# EAGLE board axiom_beta_power_board_v0.10_test (EAGLE 7.0.0), part 1 of 3
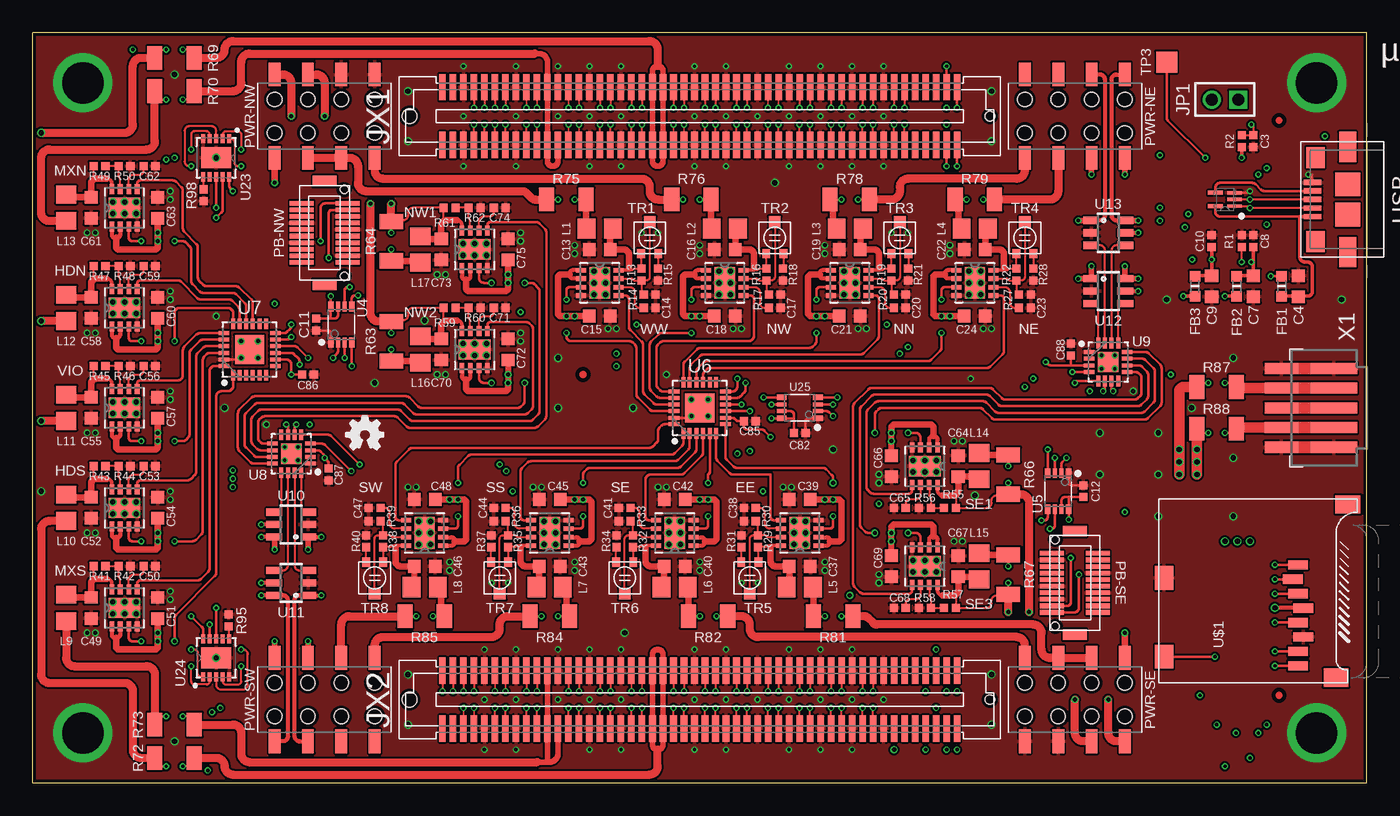
[diagram p10: board, top side]
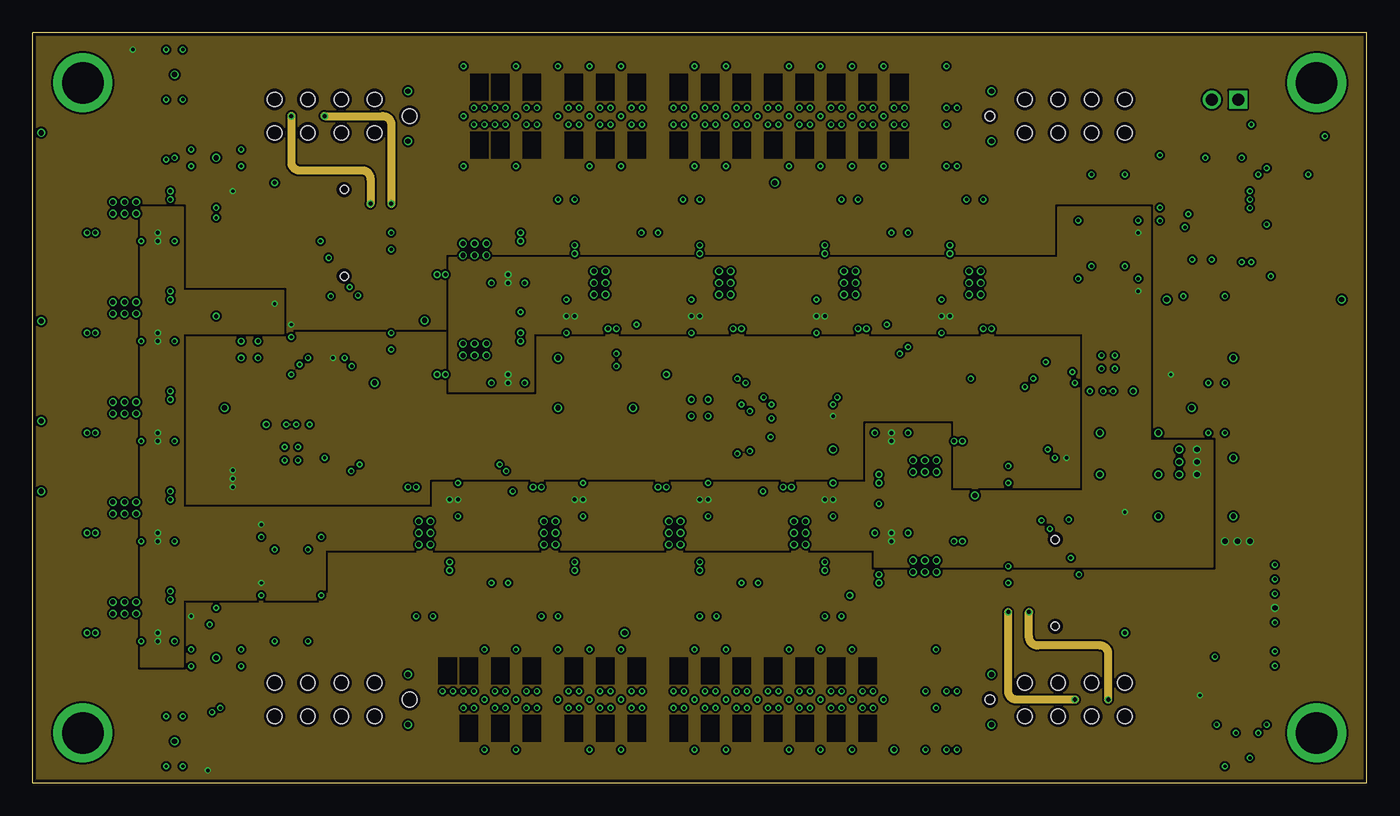
[diagram p11: board, inner layer Route2]
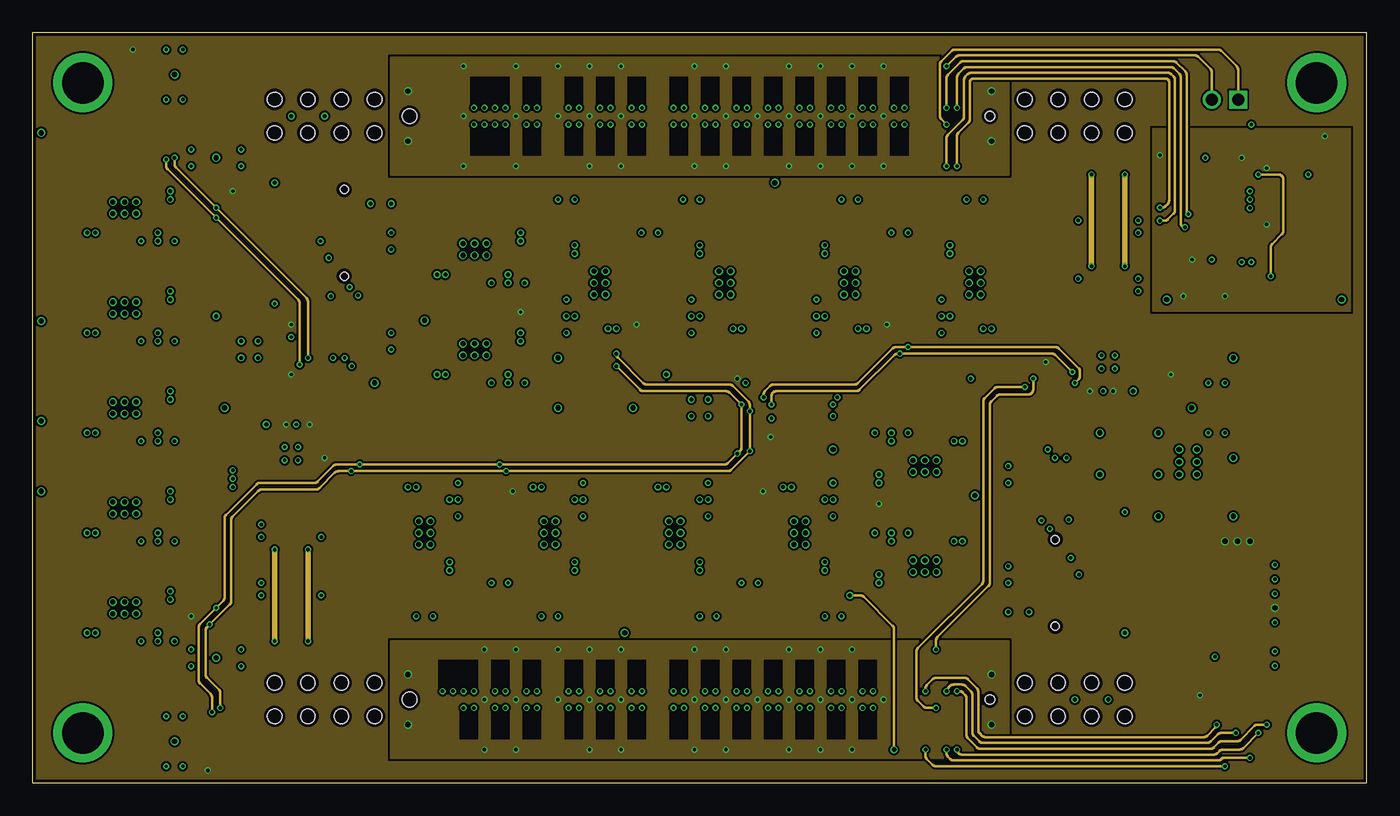
[diagram p12: board, inner layer Route15]
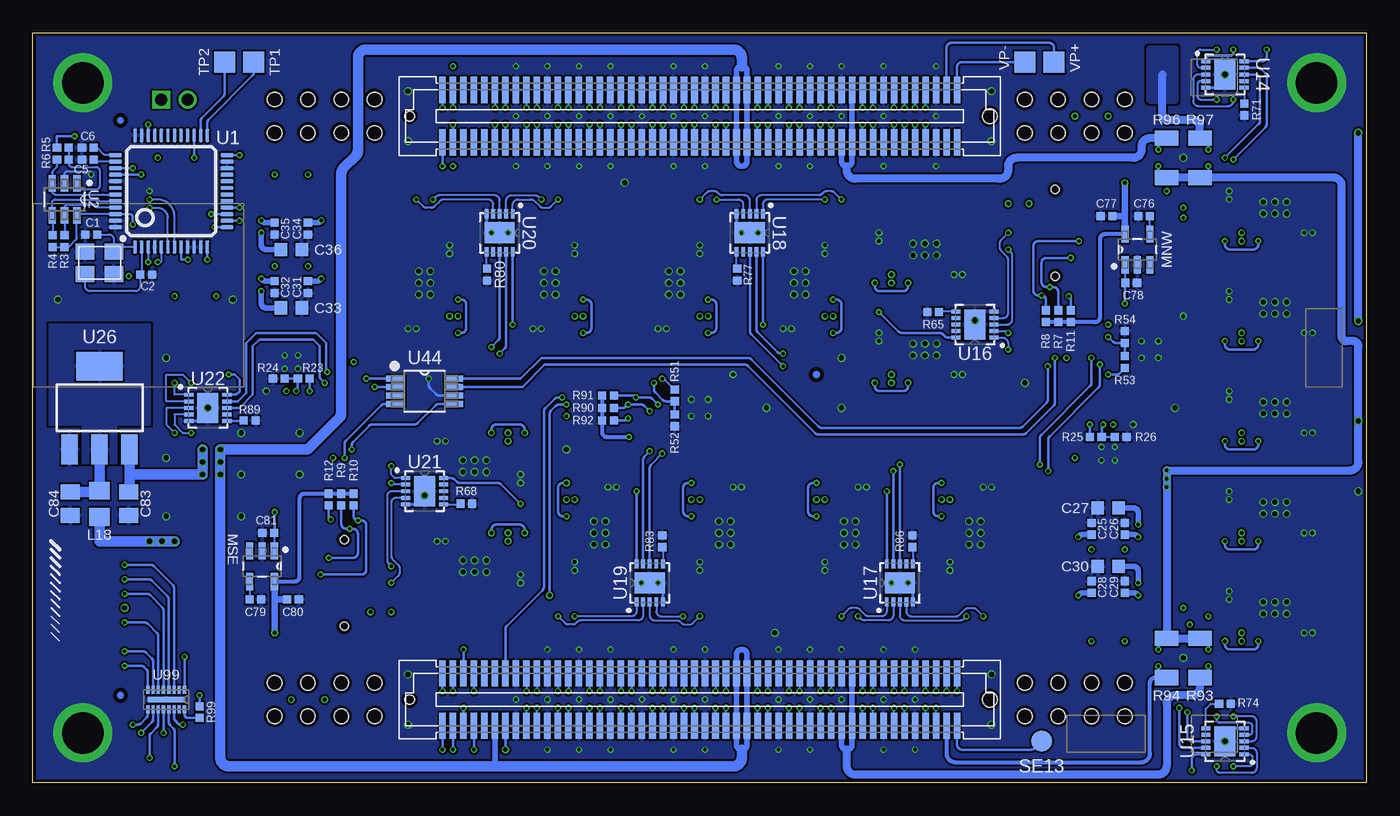
[diagram p13: board, bottom side, seen from below]

Size 101.6 x 57.15 mm. Coordinates in mm from the lower left corner, seen from the top.
Outline: 101.6,57.15 0,57.15 0,0 101.6,0 101.6,57.15
Copper layers (1*2*15*16): Top 0.035559375mm / dielectric 0.17018125mm / Route2 0.01778125mm / dielectric 47mil / Route15 0.01778125mm / dielectric 0.17018125mm / Bottom 0.035559375mm
Design rules "OSHPark-4layer-tuned *": minimum track width 5mil, minimum drill 10mil, track to track 6mil, track to pad 5mil, pad to pad 5mil, via to via 5mil, smd to smd 0mil, copper to edge 10mil, drill to drill 6mil, minimum pad ring 4mil, minimum via ring 4mil, stop-mask expansion 2mil, vias tented up to drill 16mil, thermal gap 6mil
Net classes: 1 LVDS: width 0.152 mm, drill 0.254 mm, clearance 0.152 mm
tKeepout: area 95.3,50.8 to 100.3,55.8; area 95.3,1.3 to 100.3,6.3; area 1.3,1.3 to 6.3,6.3; area 1.3,50.8 to 6.3,55.8
bKeepout: area 95.3,50.8 to 100.3,55.8; area 95.3,1.3 to 100.3,6.3; area 1.3,1.3 to 6.3,6.3; area 1.3,50.8 to 6.3,55.8
tRestrict: area 94.4,49.9 to 95.5,51; area 94.4,6.1 to 95.5,7.2; area 41.4,30.6 to 42.5,31.7
bRestrict: area 94.4,49.9 to 95.5,51; area 94.4,6.1 to 95.5,7.2; area 41.4,30.6 to 42.5,31.7

## Footprints (pad centres in the part's own frame; a part is rotated, then mirrored left to right if it is on the bottom)
µZ-SOCKET-NOHOLES = smd 0.5 x 2: 1 -19.6,-24.425; 2 -19.6,-20.027; 3 -18.8,-24.425; 4 -18.8,-20.027; 5 -18,-24.425; 6 -18,-20.027; 7 -17.2,-24.425; 8 -17.2,-20.027; 9 -16.4,-24.425; 10 -16.4,-20.027; 11 -15.6,-24.425; 12 -15.6,-20.027; 13 -14.8,-24.425; 14 -14.8,-20.027; 15 -14,-24.425; 16 -14,-20.027; 17 -13.2,-24.425; 18 -13.2,-20.027; 19 -12.4,-24.425; 20 -12.4,-20.027; 21 -11.6,-24.425; 22 -11.6,-20.027; 23 -10.8,-24.425; 24 -10.8,-20.027; 25 -10,-24.425; 26 -10,-20.027; 27 -9.2,-24.425; 28 -9.2,-20.027; 29 -8.4,-24.425; 30 -8.4,-20.027; 31 -7.6,-24.425; 32 -7.6,-20.027; 33 -6.8,-24.425; 34 -6.8,-20.027; 35 -6,-24.425; 36 -6,-20.027; 37 -5.2,-24.425; 38 -5.2,-20.027; 39 -4.4,-24.425; 40 -4.4,-20.027; 41 -3.6,-24.425; 42 -3.6,-20.027; 43 -2.8,-24.425; 44 -2.8,-20.027; 45 -2,-24.425; 46 -2,-20.027; 47 -1.2,-24.425; 48 -1.2,-20.027; 49 -0.4,-24.425; 50 -0.4,-20.027; 51 0.4,-24.425; 52 0.4,-20.027; 53 1.2,-24.425; 54 1.2,-20.027; 55 2,-24.425; 56 2,-20.027; 57 2.8,-24.425; 58 2.8,-20.027; 59 3.6,-24.425; 60 3.6,-20.027; 61 4.4,-24.425; 62 4.4,-20.027; 63 5.2,-24.425; 64 5.2,-20.027; 65 6,-24.425; 66 6,-20.027; 67 6.8,-24.425; 68 6.8,-20.027; 69 7.6,-24.425; 70 7.6,-20.027; 71 8.4,-24.425; 72 8.4,-20.027; 73 9.2,-24.425; 74 9.2,-20.027; 75 10,-24.425; 76 10,-20.027; 77 10.8,-24.425; 78 10.8,-20.027; 79 11.6,-24.425; 80 11.6,-20.027; 81 12.4,-24.425; 82 12.4,-20.027; 83 13.2,-24.425; 84 13.2,-20.027; 85 14,-24.425; 86 14,-20.027; 87 14.8,-24.425; 88 14.8,-20.027; 89 15.6,-24.425; 90 15.6,-20.027; 91 16.4,-24.425; 92 16.4,-20.027; 93 17.2,-24.425; 94 17.2,-20.027; 95 18,-24.425; 96 18,-20.027; 97 18.8,-24.425; 98 18.8,-20.027; 99 19.6,-24.425; 100 19.6,-20.027; 101 -19.6,20.025; 102 -19.6,24.425; 103 -18.8,20.027; 104 -18.8,24.425; 105 -18,20.027; 106 -18,24.425; 107 -17.2,20.027; 108 -17.2,24.425; 109 -16.4,20.027; 110 -16.4,24.425; 111 -15.6,20.027; 112 -15.6,24.425; 113 -14.8,20.027; 114 -14.8,24.425; 115 -14,20.027; 116 -14,24.425; 117 -13.2,20.027; 118 -13.2,24.425; 119 -12.4,20.027; 120 -12.4,24.425; 121 -11.6,20.027; 122 -11.6,24.425; 123 -10.8,20.027; 124 -10.8,24.425; 125 -10,20.027; 126 -10,24.425; 127 -9.2,20.027; 128 -9.2,24.425; 129 -8.4,20.027; 130 -8.4,24.425; 131 -7.6,20.027; 132 -7.6,24.425; 133 -6.8,20.027; 134 -6.8,24.425; 135 -6,20.027; 136 -6,24.425; 137 -5.2,20.027; 138 -5.2,24.425; 139 -4.4,20.027; 140 -4.4,24.425; 141 -3.6,20.027; 142 -3.6,24.425; 143 -2.8,20.027; 144 -2.8,24.425; 145 -2,20.027; 146 -2,24.425; 147 -1.2,20.027; 148 -1.2,24.425; 149 -0.4,20.027; 150 -0.4,24.425; 151 0.4,20.027; 152 0.4,24.425; 153 1.2,20.027; 154 1.2,24.425; 155 2,20.027; 156 2,24.425; 157 2.8,20.027; 158 2.8,24.425; 159 3.6,20.027; 160 3.6,24.425; 161 4.4,20.027; 162 4.4,24.425; 163 5.2,20.027; 164 5.2,24.425; 165 6,20.027; 166 6,24.425; 167 6.8,20.027; 168 6.8,24.425; 169 7.6,20.027; 170 7.6,24.425; 171 8.4,20.027; 172 8.4,24.425; 173 9.2,20.027; 174 9.2,24.425; 175 10,20.027; 176 10,24.425; 177 10.8,20.027; 178 10.8,24.425; 179 11.6,20.027; 180 11.6,24.425; 181 12.4,20.027; 182 12.4,24.425; 183 13.2,20.027; 184 13.2,24.425; 185 14,20.027; 186 14,24.425; 187 14.8,20.027; 188 14.8,24.425; 189 15.6,20.027; 190 15.6,24.425; 191 16.4,20.027; 192 16.4,24.425; 193 17.2,20.027; 194 17.2,24.425; 195 18,20.027; 196 18,24.425; 197 18.8,20.027; 198 18.8,24.425; 199 19.6,20.027; 200 19.6,24.425 | hole 0.725: -22.1,-22.225; -22.1,22.225 | hole 1.125: 22.1,-22.225; 22.1,22.225
0402-B = smd 0.62 x 0.62: 1 -0.45,0; 2 0.45,0
0603-B = smd 0.95 x 1: 1 -0.8,0; 2 0.8,0
0805-B = smd 1.15 x 1.45: 1 -0.9,0; 2 0.9,0
DFN65P300X300X100-9N = smd 0.762 x 0.356: 1 -1.422,0.965; 2 -1.422,0.33; 3 -1.422,-0.33; 4 -1.422,-0.965; 5 1.422,-0.965; 6 1.422,-0.33; 7 1.422,0.33; 8 1.422,0.965 | smd 1.549 x 2.413: 9 0,0
_0603MP = smd 0.8 x 0.8: 1 -0.762,0; 2 0.762,0
1X02M = drill 0.914 square: 1 -1,0 | drill 0.914: 2 1,0
0805-A = smd 1.35 x 1.55: 1 -1,0; 2 1,0
SOT95P280X145-5N = smd 1.321 x 0.559: 1 -1.168,0.94; 2 -1.168,0; 3 -1.168,-0.94; 4 1.168,-0.94; 5 1.168,0.94
DF12(XX)-20DP-0.5V = smd 1.8 x 0.35: 1 -1.75,2.25; 2 1.75,2.25; 3 -1.75,1.75; 4 1.75,1.75; 5 -1.75,1.25; 6 1.75,1.25; 7 -1.75,0.75; 8 1.75,0.75; 9 -1.75,0.25; 10 1.75,0.25; 11 -1.75,-0.25; 12 1.75,-0.25; 13 -1.75,-0.75; 14 1.75,-0.75; 15 -1.75,-1.25; 16 1.75,-1.25; 17 -1.75,-1.75; 18 1.75,-1.75; 19 -1.75,-2.25; 20 1.75,-2.25 | smd 1.8 x 0.8: M1 0,3.95; M2 0,-3.95 | hole 0.625: 1.5,-3.3; 1.5,3.3
R2X04 = smd 0.9 x 1.8: 1 -3.81,3.175; 2 -3.81,-3.175; 3 -1.27,3.175; 4 -1.27,-3.175; 5 1.27,3.175; 6 1.27,-3.175; 7 3.81,3.175; 8 3.81,-3.175 | hole 1.1: -3.81,1.27; -1.27,1.27; -1.27,-1.27; -3.81,-1.27; 1.27,1.27; 1.27,-1.27; 3.81,1.27; 3.81,-1.27
ABM8G = smd 1.4 x 1.2: 1 -1.1,-0.85; 2 1.1,-0.85; 3 1.1,0.85; 4 -1.1,0.85
1206-B = smd 1.15 x 1.8: 1 -1.5,0; 2 1.5,0
TP16R = smd 1.6 x 1.6: TP 0,0
TP16SQ = smd 1.6 x 1.6: TP 0,0
TRIM-PVZ2A = smd 0.6 x 0.7: 1 -0.65,-1.2; 3 0.65,-1.2 | smd 0.9 x 0.9: 2 0,1.2
LQFP48 = smd 0.3 x 1: 1 -2.75,-4.25; 2 -2.25,-4.25; 3 -1.75,-4.25; 4 -1.25,-4.25; 5 -0.75,-4.25; 6 -0.25,-4.25; 7 0.25,-4.25; 8 0.75,-4.25; 9 1.25,-4.25; 10 1.75,-4.25; 11 2.25,-4.25; 12 2.75,-4.25; 25 2.75,4.25; 26 2.25,4.25; 27 1.75,4.25; 28 1.25,4.25; 29 0.75,4.25; 30 0.25,4.25; 31 -0.25,4.25; 32 -0.75,4.25; 33 -1.25,4.25; 34 -1.75,4.25; 35 -2.25,4.25; 36 -2.75,4.25 | smd 1 x 0.3: 13 4.25,-2.75; 14 4.25,-2.25; 15 4.25,-1.75; 16 4.25,-1.25; 17 4.25,-0.75; 18 4.25,-0.25; 19 4.25,0.25; 20 4.25,0.75; 21 4.25,1.25; 22 4.25,1.75; 23 4.25,2.25; 24 4.25,2.75; 37 -4.25,2.75; 38 -4.25,2.25; 39 -4.25,1.75; 40 -4.25,1.25; 41 -4.25,0.75; 42 -4.25,0.25; 43 -4.25,-0.25; 44 -4.25,-0.75; 45 -4.25,-1.25; 46 -4.25,-1.75; 47 -4.25,-2.25; 48 -4.25,-2.75
SOT95P280X145-6N = smd 1.27 x 0.559: 1 -1.219,0.94; 2 -1.219,0; 3 -1.219,-0.94; 4 1.219,-0.94; 5 1.219,0; 6 1.219,0.94
SOT50P160X60-5N = smd 1.118 x 0.254: 1 -0.737,0.508; 2 -0.737,0; 3 -0.737,-0.508 | smd 1.118 x 0.305: 4 0.737,-0.508; 5 0.737,0.508
VSSOP-8 = smd 0.75 x 0.4: 1 -1.375,0.8; 4 -1.375,-0.8; 5 1.375,-0.8; 8 1.375,0.8 | smd 0.75 x 0.3: 2 -1.375,0.25; 3 -1.375,-0.25; 6 1.375,-0.25; 7 1.375,0.25
QFN50P400X400X80-25N = smd 0.813 x 0.305: 1 -1.956,1.245; 2 -1.956,0.762; 3 -1.956,0.254; 4 -1.956,-0.254; 5 -1.956,-0.762; 6 -1.956,-1.245; 13 1.956,-1.245; 14 1.956,-0.762; 15 1.956,-0.254; 16 1.956,0.254; 17 1.956,0.762; 18 1.956,1.245 | smd 0.305 x 0.813: 7 -1.245,-1.956; 8 -0.762,-1.956; 9 -0.254,-1.956; 10 0.254,-1.956; 11 0.762,-1.956; 12 1.245,-1.956; 19 1.245,1.956; 20 0.762,1.956; 21 0.254,1.956; 22 -0.254,1.956; 23 -0.762,1.956; 24 -1.245,1.956 | smd 2.21 x 2.21: 25 0,0
QFN50P300X300X80-17N = smd 0.813 x 0.305: 1 -1.448,0.762; 2 -1.448,0.254; 3 -1.448,-0.254; 4 -1.448,-0.762; 9 1.448,-0.762; 10 1.448,-0.254; 11 1.448,0.254; 12 1.448,0.762 | smd 0.305 x 0.813: 5 -0.762,-1.448; 6 -0.254,-1.448; 7 0.254,-1.448; 8 0.762,-1.448; 13 0.762,1.448; 14 0.254,1.448; 15 -0.254,1.448; 16 -0.762,1.448 | smd 1.549 x 1.549: EP 0,0
SOT23-6 = smd 0.55 x 1.2: 1 -0.95,-1.3; 2 0,-1.3; 3 0.95,-1.3; 4 0.95,1.3; 5 0,1.3; 6 -0.95,1.3
DFN3X3_10LEAD = smd 0.7 x 0.3: 1 -1.45,1; 2 -1.45,0.5; 3 -1.45,0; 4 -1.45,-0.5; 5 -1.45,-1; 6 1.45,-1; 7 1.45,-0.5; 8 1.45,0; 9 1.45,0.5; 10 1.45,1 | smd 1.6 x 2.3: EPAD 0,0
SOT-223 = smd 1.27 x 2.286: 1 -2.286,-3.175; 2 0,-3.175; 3 2.286,-3.175 | smd 3.556 x 2.159: TER 0,3.175
SOP65P490X110-8N = smd 1.422 x 0.457: 1 -2.21,0.965; 2 -2.21,0.33; 3 -2.21,-0.33; 4 -2.21,-0.965; 5 2.21,-0.965; 6 2.21,-0.33; 7 2.21,0.33; 8 2.21,0.965
SON40P135X330X55-17N = smd 0.61 x 0.254: 1 -0.737,1.397; 2 -0.737,0.991; 3 -0.737,0.61; 4 -0.737,0.203; 5 -0.737,-0.203; 6 -0.737,-0.61; 7 -0.737,-0.991; 8 -0.737,-1.397; 9 0.737,-1.397; 10 0.737,-0.991; 11 0.737,-0.61; 12 0.737,-0.203; 13 0.737,0.203; 14 0.737,0.61; 15 0.737,0.991; 16 0.737,1.397 | smd 0.406 x 2.794: 17 0,0
TF-MICRO-SD_PP2 = smd 0.7 x 1.5: 1 9,-10.64; 2 7.9,-10.24; 3 6.8,-10.64; 4 5.7,-11.04; 5 4.6,-10.64; 6 3.5,-11.04; 7 2.4,-10.64; 8 1.3,-10.64 | smd 1.8 x 1.4: CD1 2,-0.44; CD2 8,-0.44 | smd 1.4 x 1.9: MT1 0.4,-13.54; MT2 13.6,-14.44
MICRO-AB-H-SMT = smd 0.4 x 1.35: 1 -1.3,4.125; 2 -0.65,4.125; 3 0,4.125; 4 0.65,4.125; 5 1.3,4.125 | smd 2.3 x 1.3: Z1 -4,1.45; Z4 4,1.45 | smd 1.8 x 1.9: Z2 -1.15,1.45; Z3 1.15,1.45 | smd 1.6 x 1.4: Z5 -3.2,3.9; Z6 3.2,3.9
PICO-SPOX-5 = smd 0.85 x 2.55: 1 -3,-6.5; 2 -1.5,-6.5; 3 0,-6.5; 4 1.5,-6.5; 5 3,-6.5 | smd 0.85 x 3.55: 1A -3,-2.5; 2A -1.5,-2.5; 3A 0,-2.5; 4A 1.5,-2.5; 5A 3,-2.5
µZ-CONONLY = smd 0.5 x 2: 1 19.6,-24.226; 2 19.6,-20.226; 3 18.8,-24.226; 4 18.8,-20.226; 5 18,-24.226; 6 18,-20.226; 7 17.2,-24.226; 8 17.2,-20.226; 9 16.4,-24.226; 10 16.4,-20.226; 11 15.6,-24.226; 12 15.6,-20.226; 13 14.8,-24.226; 14 14.8,-20.226; 15 14,-24.226; 16 14,-20.226; 17 13.2,-24.226; 18 13.2,-20.226; 19 12.4,-24.226; 20 12.4,-20.226; 21 11.6,-24.226; 22 11.6,-20.226; 23 10.8,-24.226; 24 10.8,-20.226; 25 10,-24.226; 26 10,-20.226; 27 9.2,-24.226; 28 9.2,-20.226; 29 8.4,-24.226; 30 8.4,-20.226; 31 7.6,-24.226; 32 7.6,-20.226; 33 6.8,-24.226; 34 6.8,-20.226; 35 6,-24.226; 36 6,-20.226; 37 5.2,-24.226; 38 5.2,-20.226; 39 4.4,-24.226; 40 4.4,-20.226; 41 3.6,-24.226; 42 3.6,-20.226; 43 2.8,-24.226; 44 2.8,-20.226; 45 2,-24.226; 46 2,-20.226; 47 1.2,-24.226; 48 1.2,-20.226; 49 0.4,-24.226; 50 0.4,-20.226; 51 -0.4,-24.226; 52 -0.4,-20.226; 53 -1.2,-24.226; 54 -1.2,-20.226; 55 -2,-24.226; 56 -2,-20.226; 57 -2.8,-24.226; 58 -2.8,-20.226; 59 -3.6,-24.226; 60 -3.6,-20.226; 61 -4.4,-24.226; 62 -4.4,-20.226; 63 -5.2,-24.226; 64 -5.2,-20.226; 65 -6,-24.226; 66 -6,-20.226; 67 -6.8,-24.226; 68 -6.8,-20.226; 69 -7.6,-24.226; 70 -7.6,-20.226; 71 -8.4,-24.226; 72 -8.4,-20.226; 73 -9.2,-24.226; 74 -9.2,-20.226; 75 -10,-24.226; 76 -10,-20.226; 77 -10.8,-24.226; 78 -10.8,-20.226; 79 -11.6,-24.226; 80 -11.6,-20.226; 81 -12.4,-24.226; 82 -12.4,-20.226; 83 -13.2,-24.226; 84 -13.2,-20.226; 85 -14,-24.226; 86 -14,-20.226; 87 -14.8,-24.226; 88 -14.8,-20.226; 89 -15.6,-24.226; 90 -15.6,-20.226; 91 -16.4,-24.226; 92 -16.4,-20.226; 93 -17.2,-24.226; 94 -17.2,-20.226; 95 -18,-24.226; 96 -18,-20.226; 97 -18.8,-24.226; 98 -18.8,-20.226; 99 -19.6,-24.226; 100 -19.6,-20.226; 101 19.6,20.226; 102 19.6,24.226; 103 18.8,20.226; 104 18.8,24.226; 105 18,20.226; 106 18,24.226; 107 17.2,20.226; 108 17.2,24.226; 109 16.4,20.226; 110 16.4,24.226; 111 15.6,20.226; 112 15.6,24.226; 113 14.8,20.226; 114 14.8,24.226; 115 14,20.226; 116 14,24.226; 117 13.2,20.226; 118 13.2,24.226; 119 12.4,20.226; 120 12.4,24.226; 121 11.6,20.226; 122 11.6,24.226; 123 10.8,20.226; 124 10.8,24.226; 125 10,20.226; 126 10,24.226; 127 9.2,20.226; 128 9.2,24.226; 129 8.4,20.226; 130 8.4,24.226; 131 7.6,20.226; 132 7.6,24.226; 133 6.8,20.226; 134 6.8,24.226; 135 6,20.226; 136 6,24.226; 137 5.2,20.226; 138 5.2,24.226; 139 4.4,20.226; 140 4.4,24.226; 141 3.6,20.226; 142 3.6,24.226; 143 2.8,20.226; 144 2.8,24.226; 145 2,20.226; 146 2,24.226; 147 1.2,20.226; 148 1.2,24.226; 149 0.4,20.226; 150 0.4,24.226; 151 -0.4,20.226; 152 -0.4,24.226; 153 -1.2,20.226; 154 -1.2,24.226; 155 -2,20.226; 156 -2,24.226; 157 -2.8,20.226; 158 -2.8,24.226; 159 -3.6,20.226; 160 -3.6,24.226; 161 -4.4,20.226; 162 -4.4,24.226; 163 -5.2,20.226; 164 -5.2,24.226; 165 -6,20.226; 166 -6,24.226; 167 -6.8,20.226; 168 -6.8,24.226; 169 -7.6,20.226; 170 -7.6,24.226; 171 -8.4,20.226; 172 -8.4,24.226; 173 -9.2,20.226; 174 -9.2,24.226; 175 -10,20.226; 176 -10,24.226; 177 -10.8,20.226; 178 -10.8,24.226; 179 -11.6,20.226; 180 -11.6,24.226; 181 -12.4,20.226; 182 -12.4,24.226; 183 -13.2,20.226; 184 -13.2,24.226; 185 -14,20.226; 186 -14,24.226; 187 -14.8,20.226; 188 -14.8,24.226; 189 -15.6,20.226; 190 -15.6,24.226; 191 -16.4,20.226; 192 -16.4,24.226; 193 -17.2,20.226; 194 -17.2,24.226; 195 -18,20.226; 196 -18,24.226; 197 -18.8,20.226; 198 -18.8,24.226; 199 -19.6,20.226; 200 -19.6,24.226 | hole 1.125: -22.1,-22.225; -22.1,22.225 | hole 0.725: 22.1,-22.225; 22.1,22.225

## Placement (x,y rotation side)
BETA  µZ-FCI-SOCKET-NOHOLES  [µZ-SOCKET-NOHOLES]  50.8,28.57 180 top
C1  [0402-B]  97.16,41.78 180 bottom
C2  [0402-B]  92.96,38.73 0 bottom
C3  10n  [0402-B]  92.96,48.89 270 top
C4  100n  [0603-B]  96.39,37.85 90 top
C5  100n  [0402-B]  97.41,47.5 180 bottom
C6  100n  [0402-B]  97.41,48.39 180 bottom
C7  4µ7  [0603-B]  92.96,37.85 270 top
C8  100n  [0402-B]  92.96,41.27 90 top
C9  4µ7  [0603-B]  89.79,37.85 270 top
C10  100n  [0402-B]  89.79,41.27 90 top
C11  [0402-B]  21.59,34.92 270 top
C12  [0402-B]  80.01,22.23 90 top
C13  [0603-B]  43.18,40.64 180 top
C14  [0402-B]  46.99,36.2 0 top
C15  [0603-B]  43.18,35.56 0 top
C16  [0603-B]  52.7,40.64 180 top
C17  [0402-B]  56.52,36.2 0 top
C18  [0603-B]  52.7,35.56 0 top
C19  [0603-B]  62.23,40.64 180 top
C20  [0402-B]  66.04,36.2 0 top
C21  [0603-B]  62.23,35.56 0 top
C22  [0603-B]  71.75,40.64 180 top
C23  [0402-B]  75.56,36.2 0 top
C24  [0603-B]  71.75,35.56 0 top
C25  1µ  [0402-B]  20.95,19.37 90 bottom
C26  1µ  [0402-B]  18.41,19.37 90 bottom
C27  1µ  [0603-B]  19.68,20.95 180 bottom
C28  1µ  [0402-B]  20.95,14.92 90 bottom
C29  1µ  [0402-B]  18.41,14.92 90 bottom
C30  1µ  [0603-B]  19.68,16.51 180 bottom
C31  1µ  [0402-B]  80.64,37.78 270 bottom
C32  1µ  [0402-B]  83.19,37.78 270 bottom
C33  1µ  [0603-B]  81.91,36.2 0 bottom
C34  1µ  [0402-B]  80.64,42.23 270 bottom
C35  1µ  [0402-B]  83.19,42.23 270 bottom
C36  1µ  [0603-B]  81.91,40.64 0 bottom
C37  [0603-B]  58.42,16.51 0 top
C38  [0402-B]  54.61,20.95 180 top
C39  [0603-B]  58.42,21.59 180 top
C40  [0603-B]  48.89,16.51 0 top
C41  [0402-B]  45.08,20.95 180 top
C42  [0603-B]  48.89,21.59 180 top
C43  [0603-B]  39.37,16.51 0 top
C44  [0402-B]  35.56,20.95 180 top
C45  [0603-B]  39.37,21.59 180 top
C46  [0603-B]  29.84,16.51 0 top
C47  [0402-B]  26.03,20.95 180 top
C48  [0603-B]  29.84,21.59 180 top
C49  [0603-B]  4.45,13.33 270 top
C50  [0402-B]  8.89,16.51 0 top
C51  [0603-B]  9.52,13.33 90 top
C52  [0603-B]  4.45,20.95 270 top
C53  [0402-B]  8.89,24.13 0 top
C54  [0603-B]  9.52,20.95 90 top
C55  [0603-B]  4.45,28.57 270 top
C56  [0402-B]  8.89,31.75 0 top
C57  [0603-B]  9.52,28.57 90 top
C58  [0603-B]  4.45,36.2 270 top
C59  [0402-B]  8.89,39.37 0 top
C60  [0603-B]  9.52,36.2 90 top
C61  [0603-B]  4.45,43.81 270 top
C62  [0402-B]  8.89,46.99 0 top
C63  [0603-B]  9.52,43.81 90 top
C64  [0603-B]  70.48,24.13 90 top
C65  [0402-B]  66.04,20.95 180 top
C66  [0603-B]  65.41,24.13 270 top
C67  [0603-B]  70.48,16.51 90 top
C68  [0402-B]  66.04,13.33 180 top
C69  [0603-B]  65.41,16.51 270 top
C70  [0603-B]  31.11,33.02 270 top
C71  [0402-B]  35.56,36.2 0 top
C72  [0603-B]  36.19,33.02 90 top
C73  [0603-B]  31.11,40.64 270 top
C74  [0402-B]  35.56,43.81 0 top
C75  [0603-B]  36.19,40.64 90 top
C76  [0402-B]  16.95,43.18 180 bottom
C77  [0402-B]  19.81,43.18 180 bottom
C78  [0402-B]  17.93,38.1 0 bottom
C79  [0402-B]  84.65,13.97 0 bottom
C80  [0402-B]  81.79,13.97 0 bottom
C81  [0402-B]  83.67,19.05 180 bottom
C82  [0402-B]  58.42,26.67 0 top
C83  [0805-B]  94.3,21.27 270 bottom
C84  [0805-B]  98.74,21.27 270 bottom
C85  [0402-B]  54.61,27.56 0 top
C86  [0402-B]  20.95,31.11 0 top
C87  [0402-B]  22.54,23.49 270 top
C88  [0402-B]  79.06,33.02 90 top
EE  MCP1727-ADJE/MF  [DFN65P300X300X100-9N]  58.42,19.05 180 top
FB1  600R  [_0603MP]  95.12,37.85 90 top
FB2  600R  [_0603MP]  91.69,37.85 90 top
FB3  600R  [_0603MP]  88.52,37.85 90 top
HDN  MCP1727-ADJE/MF  [DFN65P300X300X100-9N]  6.98,36.2 90 top
HDS  MCP1727-ADJE/MF  [DFN65P300X300X100-9N]  6.98,20.95 90 top
JP1  [1X02M]  90.81,52.07 180 top
L1  [0805-A]  43.18,42.23 180 top
L2  [0805-A]  52.7,42.23 180 top
L3  [0805-A]  62.23,42.23 180 top
L4  [0805-A]  71.75,42.23 180 top
L5  [0805-A]  58.42,14.92 0 top
L6  [0805-A]  48.89,14.92 0 top
L7  [0805-A]  39.37,14.92 0 top
L8  [0805-A]  29.84,14.92 0 top
L9  [0805-A]  2.54,13.33 270 top
L10  [0805-A]  2.54,20.95 270 top
L11  [0805-A]  2.54,28.57 270 top
L12  [0805-A]  2.54,36.2 270 top
L13  [0805-A]  2.54,43.81 270 top
L14  [0805-A]  72.07,24.13 90 top
L15  [0805-A]  72.07,16.51 90 top
L16  [0805-A]  29.53,33.02 270 top
L17  [0805-A]  29.53,40.64 270 top
L18  [0805-A]  96.52,21.27 270 bottom
LOGO1  OSHW_LOGO_FILLX0100-NT  [OSHW_FILLX100_NOTEXT]  23.88,25.4 0 top
MNW  SPX3819M5-L  [SOT95P280X145-5N]  17.46,40.64 90 bottom
MSE  SPX3819M5-L  [SOT95P280X145-5N]  84.14,16.51 270 bottom
MXN  MCP1727-ADJE/MF  [DFN65P300X300X100-9N]  6.98,43.81 90 top
MXS  MCP1727-ADJE/MF  [DFN65P300X300X100-9N]  6.98,13.33 90 top
NE  MCP1727-ADJE/MF  [DFN65P300X300X100-9N]  71.75,38.1 0 top
NN  MCP1727-ADJE/MF  [DFN65P300X300X100-9N]  62.23,38.1 0 top
NW  MCP1727-ADJE/MF  [DFN65P300X300X100-9N]  52.7,38.1 0 top
NW1  MCP1727-ADJE/MF  [DFN65P300X300X100-9N]  33.66,40.64 90 top
NW2  MCP1727-ADJE/MF  [DFN65P300X300X100-9N]  33.66,33.02 90 top
PB-NW  DF12(XX)-20DP-0.5V  [DF12(XX)-20DP-0.5V]  22.22,41.91 0 top
PB-SE  DF12(XX)-20DP-0.5V  [DF12(XX)-20DP-0.5V]  79.38,15.24 180 top
PWR-NE  PINRC-2X04  [R2X04]  79.38,50.8 180 top
PWR-NW  PINRC-2X04  [R2X04]  22.22,50.8 0 top
PWR-SE  PINRC-2X04  [R2X04]  79.38,6.35 180 top
PWR-SW  PINRC-2X04  [R2X04]  22.22,6.35 0 top
Q1  SMD-4P-2G-3.2X2.5  [ABM8G]  96.52,39.62 180 bottom
R1  12k  [0402-B]  92.07,41.27 270 top
R2  10k  [0402-B]  92.07,48.89 270 top
R3  10k  [0402-B]  99.19,41.27 270 bottom
R4  10k  [0402-B]  100.08,41.27 270 bottom
R5  10k  [0402-B]  99.31,48.39 180 bottom
R6  2k  [0402-B]  99.31,47.5 180 bottom
R7  [0402-B]  23.49,35.56 90 bottom
R8  [0402-B]  24.45,35.56 90 bottom
R9  [0402-B]  78.1,21.59 270 bottom
R10  [0402-B]  77.15,21.59 270 bottom
R11  [0402-B]  22.54,35.56 90 bottom
R12  [0402-B]  79.06,21.59 270 bottom
R13  [0402-B]  46.35,38.73 270 top
R14  [0402-B]  46.99,37.21 0 top
R15  [0402-B]  47.62,38.73 270 top
R16  [0402-B]  55.88,38.73 270 top
R17  [0402-B]  56.52,37.21 0 top
R18  [0402-B]  57.15,38.73 270 top
R19  [0402-B]  65.41,38.73 270 top
R20  [0402-B]  66.04,37.21 0 top
R21  [0402-B]  66.67,38.73 270 top
R22  [0402-B]  74.93,38.73 270 top
R23  [0402-B]  80.96,30.8 180 bottom
R24  [0402-B]  82.87,30.8 180 bottom
R25  [0402-B]  20.64,26.35 0 bottom
R26  [0402-B]  18.73,26.35 0 bottom
R27  [0402-B]  75.56,37.21 0 top
R28  [0402-B]  76.2,38.73 270 top
R29  [0402-B]  55.24,18.41 90 top
R30  [0402-B]  54.61,19.94 180 top
R31  [0402-B]  53.97,18.41 90 top
R32  [0402-B]  45.72,18.41 90 top
R33  [0402-B]  45.08,19.94 180 top
R34  [0402-B]  44.45,18.41 90 top
R35  [0402-B]  36.19,18.41 90 top
R36  [0402-B]  35.56,19.94 180 top
R37  [0402-B]  34.92,18.41 90 top
R38  [0402-B]  26.67,18.41 90 top
R39  [0402-B]  26.03,19.94 180 top
R40  [0402-B]  25.4,18.41 90 top
R41  [0402-B]  5.08,16.51 0 top
R42  [0402-B]  6.98,16.51 0 top
R43  [0402-B]  5.08,24.13 0 top
R44  [0402-B]  6.98,24.13 0 top
R45  [0402-B]  5.08,31.75 0 top
R46  [0402-B]  6.98,31.75 0 top
R47  [0402-B]  5.08,39.37 0 top
R48  [0402-B]  6.98,39.37 0 top
R49  [0402-B]  5.08,46.99 0 top
R50  [0402-B]  6.98,46.99 0 top
R51  [0402-B]  52.7,29.53 270 bottom
R52  [0402-B]  52.7,27.62 270 bottom
R53  [0402-B]  18.41,32.07 90 bottom
R54  [0402-B]  18.41,33.97 90 bottom
R55  [0402-B]  69.85,20.95 180 top
R56  [0402-B]  67.94,20.95 180 top
R57  [0402-B]  69.85,13.33 180 top
R58  [0402-B]  67.94,13.33 180 top
R59  [0402-B]  31.75,36.2 0 top
R60  [0402-B]  33.66,36.2 0 top
R61  [0402-B]  31.75,43.81 0 top
R62  [0402-B]  33.66,43.81 0 top
R63  [1206-B]  27.3,33.66 90 top
R64  [1206-B]  27.3,41.27 90 top
R65  [0402-B]  33.02,35.88 180 bottom
R66  [1206-B]  74.3,23.49 270 top
R67  [1206-B]  74.3,15.88 270 top
R68  [0402-B]  68.58,21.27 0 bottom
R69  [1206-B]  10.79,55.25 0 top
R70  [1206-B]  10.79,52.7 0 top
R71  [0402-B]  9.33,51.31 270 bottom
R72  [1206-B]  10.79,1.9 0 top
R73  [1206-B]  10.79,4.45 0 top
R74  [0402-B]  10.79,6.03 0 bottom
R75  [1206-B]  40.64,44.45 180 top
R76  [1206-B]  50.16,44.45 180 top
R77  [0402-B]  47.94,38.73 270 bottom
R78  [1206-B]  62.23,44.45 0 top
R79  [1206-B]  71.75,44.45 0 top
R80  [0402-B]  66.99,38.73 270 bottom
R81  [1206-B]  60.96,12.7 0 top
R82  [1206-B]  51.43,12.7 0 top
R83  [0402-B]  53.66,18.41 90 bottom
R84  [1206-B]  39.37,12.7 180 top
R85  [1206-B]  29.84,12.7 180 top
R86  [0402-B]  34.61,18.41 90 bottom
R87  [1206-B]  90.17,30.16 180 top
R88  [1206-B]  90.17,26.99 180 top
R89  [0402-B]  85.09,27.62 0 bottom
R90  [0402-B]  57.78,28.57 0 bottom
R91  [0402-B]  57.78,29.53 0 bottom
R92  [0402-B]  57.78,27.62 0 bottom
R93  [1206-B]  12.7,9.52 270 bottom
R94  [1206-B]  15.24,9.52 270 bottom
R95  [0402-B]  14.92,12.38 90 top
R96  [1206-B]  15.24,47.62 90 bottom
R97  [1206-B]  12.7,47.62 90 bottom
R98  [0402-B]  13.02,44.77 270 top
R99  [0402-B]  88.9,5.4 270 bottom
SE  MCP1727-ADJE/MF  [DFN65P300X300X100-9N]  48.89,19.05 180 top
SE1  MCP1727-ADJE/MF  [DFN65P300X300X100-9N]  67.94,24.13 270 top
SE3  MCP1727-ADJE/MF  [DFN65P300X300X100-9N]  67.94,16.51 270 top
SE13  TPTP16R  [TP16R]  24.76,3.18 90 bottom
SS  MCP1727-ADJE/MF  [DFN65P300X300X100-9N]  39.37,19.05 180 top
SW  MCP1727-ADJE/MF  [DFN65P300X300X100-9N]  29.84,19.05 180 top
TP1  TPTP16SQ  [TP16SQ]  84.77,54.93 270 bottom
TP2  TPTP16SQ  [TP16SQ]  87,54.93 270 bottom
TP3  TPTP16SQ  [TP16SQ]  86.36,54.93 0 top
TR1  PVZ2A  [TRIM-PVZ2A]  46.99,41.53 0 top
TR2  PVZ2A  [TRIM-PVZ2A]  56.52,41.53 0 top
TR3  PVZ2A  [TRIM-PVZ2A]  66.04,41.53 0 top
TR4  PVZ2A  [TRIM-PVZ2A]  75.56,41.53 0 top
TR5  PVZ2A  [TRIM-PVZ2A]  54.61,15.62 180 top
TR6  PVZ2A  [TRIM-PVZ2A]  45.08,15.62 180 top
TR7  PVZ2A  [TRIM-PVZ2A]  35.56,15.62 180 top
TR8  PVZ2A  [TRIM-PVZ2A]  26.03,15.62 180 top
U1  FT232H  [LQFP48]  91.06,45.09 0 bottom
U2  93LC46BT-I/OT  [SOT95P280X145-6N]  99.19,44.45 270 bottom
U3  TPD3E001DRLR  [SOT50P160X60-5N]  90.81,44.45 180 top
U4  GTL2002DC  [VSSOP-8]  23.49,34.92 90 top
U5  GTL2002DC  [VSSOP-8]  78.1,22.23 270 top
U6  MCP23018QFN  [QFN50P400X400X80-25N]  50.8,28.57 90 top
U7  MCP23018QFN  [QFN50P400X400X80-25N]  16.51,33.02 90 top
U8  MCP23009-E/MG  [QFN50P300X300X80-17N]  19.68,25.08 180 top
U9  MCP23009-E/MG  [QFN50P300X300X80-17N]  81.91,32.07 0 top
U10  [SOT23-6]  19.68,19.68 90 top
U11  [SOT23-6]  19.68,15.24 90 top
U12  [SOT23-6]  81.91,37.47 270 top
U13  [SOT23-6]  81.91,41.91 270 top
U14  PAC1720  [DFN3X3_10LEAD]  10.79,53.97 0 bottom
U15  PAC1720  [DFN3X3_10LEAD]  10.79,3.18 180 bottom
U16  PAC1720  [DFN3X3_10LEAD]  29.84,34.92 180 bottom
U17  PAC1720  [DFN3X3_10LEAD]  35.56,15.24 90 bottom
U18  PAC1720  [DFN3X3_10LEAD]  46.99,41.91 270 bottom
U19  PAC1720  [DFN3X3_10LEAD]  54.61,15.24 90 bottom
U20  PAC1720  [DFN3X3_10LEAD]  66.04,41.91 270 bottom
U21  PAC1720  [DFN3X3_10LEAD]  71.75,22.23 0 bottom
U22  PAC1720  [DFN3X3_10LEAD]  88.27,28.57 0 bottom
U23  PAC1720  [DFN3X3_10LEAD]  13.97,47.62 270 top
U24  PAC1720  [DFN3X3_10LEAD]  13.97,9.52 90 top
U25  GTL2002DC  [VSSOP-8]  58.42,28.57 180 top
U26  LD1117S  [SOT-223]  96.52,28.57 0 bottom
U44  PCA9540BDP  [SOP65P490X110-8N]  71.75,29.84 0 bottom
U99  IP4251CZ16-8-TTL  [SON40P135X330X55-17N]  91.44,6.35 270 bottom
U$1  MICRO-SD-2CD  [TF-MICRO-SD_PP2]  85.72,7.62 90 top
USB  5_USB_3S  [MICRO-AB-H-SMT]  101.6,44.45 90 top
VIO  MCP1727-ADJE/MF  [DFN65P300X300X100-9N]  6.98,28.57 90 top
VP+  TPTP16SQ  [TP16SQ]  23.81,54.93 0 bottom
VP-  TPTP16SQ  [TP16SQ]  26.03,54.93 0 bottom
WW  MCP1727-ADJE/MF  [DFN65P300X300X100-9N]  43.18,38.1 0 top
X1  PICO-SPOX-5  [PICO-SPOX-5]  101.6,28.57 270 top
ZED  µZ-FCI-CONONLY  [µZ-CONONLY]  50.8,28.57 180 bottom

## Tracks (layer width: path | path; a pad name or v marks a point on that pad's centre or on a via)
A_SCL  (via drill 0.25 pad 0.25)
  Top 0.203: PB-NW.2 22.29,44.16 arc90 21.91,43.78 v21.91,41.27 | v24.76,37.15 24.55,37.15 arc90 24.29,36.89 U4.5
  Bottom 0.203: v21.91,41.27 25.02,41.27 arc-90 25.4,40.89 25.4,37.53 arc-90 25.02,37.15 v24.76,37.15 arc90 24.45,36.83 R8.2
A_SCL'  (via drill 0.25 pad 0.25)
  Top 0.203: v24.29,31.75 U4.4
  Bottom 0.203: U44.8 64.44,30.81 62.86,32.38 47.15,32.38 arc45 46.88,32.27 41.77,27.16 arc-45 41.5,27.05 26.45,27.05 arc-45 26.18,27.16 24.41,28.93 arc-45 24.29,29.2 v24.29,31.75
A_SDA  (via drill 0.25 pad 0.25)
  Top 0.203: PB-NW.4 22.8,43.66 arc90 22.54,43.41 v22.54,40 | v24.13,37.78 24,37.78 arc90 23.74,37.53 U4.6
  Bottom 0.203: v22.54,40 24.38,40 arc-90 24.76,39.62 24.76,38.16 arc-90 24.38,37.78 v24.13,37.78 23.88,37.78 arc90 23.49,37.4 R7.2
A_SDA'  (via drill 0.25 pad 0.25)
  Top 0.203: v23.74,32.38 U4.3
  Bottom 0.203: U44.7 64.31,30.18 62.61,31.88 47.4,31.88 arc45 47.13,31.77 42.02,26.66 arc-45 41.75,26.54 26.19,26.54 arc-45 25.92,26.66 23.86,28.72 arc-45 23.74,28.99 v23.74,32.38
B_SCL  (via drill 0.25 pad 0.25)
  Top 0.203: PB-SE.2 79.31,12.99 arc90 79.69,13.37 v79.69,15.88 | v76.83,20 77.05,20 arc90 77.3,20.26 U5.5
  Bottom 0.203: R10.2 77.15,20.32 arc-90 v76.83,20 76.58,20 arc90 76.2,19.62 76.2,16.26 arc90 76.58,15.88 v79.69,15.88
B_SCL'  (via drill 0.25 pad 0.25)
  Top 0.203: v77.3,25.4 U5.4
  Bottom 0.203: U44.5 70.66,28.88 arc-45 70.93,28.77 72.28,27.42 arc45 72.55,27.3 75.72,27.3 arc-45 75.99,27.19 77.19,25.99 arc-45 77.3,25.72 v77.3,25.4
B_SDA  (via drill 0.25 pad 0.25)
  Top 0.203: PB-SE.4 78.8,13.49 arc90 79.06,13.74 v79.06,17.14 | v77.47,19.37 77.6,19.37 arc90 77.85,19.62 U5.6
  Bottom 0.203: R9.2 78.1,19.75 arc-90 77.72,19.37 v77.47,19.37 77.22,19.37 arc90 76.83,18.99 76.83,17.53 arc90 77.22,17.14 v79.06,17.14
B_SDA'  (via drill 0.25 pad 0.25)
  Top 0.203: v77.85,24.77 U5.3
  Bottom 0.203: U44.4 74.78,28.88 arc-45 75.05,28.77 77.74,26.08 arc-45 77.85,25.81 v77.85,24.77
BANK13_00_N  (via drill 0.25)
  Top 0.152: BETA.87 v36,51.44
  Bottom 0.152: ZED.87 v36,51.44
BANK13_00_P  (via drill 0.25)
  Top 0.152: BETA.89 v35.2,51.44
  Bottom 0.152: ZED.89 v35.2,51.44
BANK13_01_N  (via drill 0.25)
  Top 0.152: BETA.90 v35.2,50.16
  Bottom 0.152: ZED.90 v35.2,50.16
BANK13_01_P  (via drill 0.25)
  Top 0.152: BETA.88 v36,50.16
  Bottom 0.152: ZED.88 v36,50.16
BANK13_02_N  (via drill 0.25)
  Top 0.152: BETA.91 v34.4,51.44
  Bottom 0.152: ZED.91 v34.4,51.44
BANK13_02_P  (via drill 0.25)
  Top 0.152: BETA.93 v33.6,51.44
  Bottom 0.152: ZED.93 v33.6,51.44
BANK13_03_N  (via drill 0.25)
  Top 0.152: BETA.92 v34.4,50.16
  Bottom 0.152: ZED.92 v34.4,50.16
BANK13_03_P  (via drill 0.25)
  Top 0.152: BETA.94 v33.6,50.16
  Bottom 0.152: ZED.94 v33.6,50.16
BANK13_04_N  (via drill 0.25)
  Top 0.152: BETA.193 v33.6,6.98
  Bottom 0.152: ZED.193 v33.6,6.98
BANK13_04_P  (via drill 0.25)
  Top 0.152: BETA.195 v32.8,6.98
  Bottom 0.152: ZED.195 v32.8,6.98
BANK13_05_N  (via drill 0.25)
  Top 0.127: BETA.196 v32.8,5.71
  Bottom 0.127: ZED.196 v32.8,5.71
BANK13_05_P  (via drill 0.25)
  Top 0.127: BETA.194 v33.6,5.71
  Bottom 0.127: ZED.194 v33.6,5.71
BANK13_06_N  (via drill 0.25)
  Top 0.152: BETA.199 v31.2,6.98
  Bottom 0.152: ZED.199 v31.2,6.98
BANK13_06_P  (via drill 0.25)
  Top 0.152: BETA.197 v32,6.98
  Bottom 0.152: ZED.197 v32,6.98
BANK13_SE_0
  Bottom 0.203: ZED.200 31.2,2.92 arc-90 30.82,2.54 25.56,2.54 arc-45 25.29,2.65 SE13.TP
BETA_5V  (via drill 0.25 pad 0.25)
  Top 0.152: 91.67,27.07 91.27,26.67 v90.81,26.67
  Top 0.813: X1.4A X1.4 91.67,27.07 R88.1
  Bottom 0.152: U22.3 91.44,28.57 91.44,27.3 v90.81,26.67
BETA_5V'  (via drill 0.25 pad 0.25, 0.3 pad 0.25, 0.41 pad 0.25)
  Top 0.152: R88.2 88.99,26.67 v89.53,26.67
  Top 0.305: WW.2 41.15,38.43 arc-90 40.89,38.68 40.89,38.75 40.89,38.81 arc-90 41.15,39.06 WW.1 | EE.2 60.45,18.72 arc-90 60.71,18.47 60.71,18.4 60.71,18.34 arc-90 60.45,18.09 EE.1 | NW.2 50.67,38.43 arc-90 50.42,38.68 50.42,38.75 50.42,38.81 arc-90 50.67,39.06 NW.1 | SE.2 50.93,18.72 arc-90 51.18,18.47 51.18,18.4 51.18,18.34 arc-90 50.93,18.09 SE.1 | NN.2 60.2,38.43 arc-90 59.94,38.68 59.94,38.75 59.94,38.81 arc-90 60.2,39.06 NN.1 | SS.2 41.4,18.72 arc-90 41.66,18.47 41.66,18.4 41.66,18.34 arc-90 41.4,18.09 SS.1 | NE.2 69.72,38.43 arc-90 69.47,38.68 69.47,38.75 69.47,38.81 arc-90 69.72,39.06 NE.1 | SW.2 31.88,18.72 arc-90 32.13,18.47 32.13,18.4 32.13,18.34 arc-90 31.88,18.09 SW.1 | VIO.1 6.02,26.54 arc90 6.27,26.29 6.34,26.29 6.4,26.29 arc90 6.65,26.54 VIO.2 | MXN.1 6.02,41.78 arc90 6.27,41.53 6.34,41.53 6.4,41.53 arc90 6.65,41.78 MXN.2 | SE1.2 68.28,26.16 arc-90 68.53,26.42 68.59,26.42 68.66,26.42 arc-90 68.91,26.16 SE1.1 | SE3.1 68.91,18.54 arc90 68.66,18.8 68.59,18.8 68.53,18.8 arc90 68.28,18.54 SE3.2 | NW1.1 32.69,38.61 arc90 32.94,38.35 33.01,38.35 33.07,38.35 arc90 33.32,38.61 NW1.2 | NW2.2 33.32,30.99 arc-90 33.07,30.73 33.01,30.73 32.94,30.73 arc-90 32.69,30.99 NW2.1 | U12.5 v84.2,37.47 | U13.5 v84.2,41.91 | U10.5 v17.4,19.68 | U11.5 v17.4,15.24 | HDN.1 6.02,34.16 arc90 6.27,33.91 6.34,33.91 6.4,33.91 arc90 6.65,34.16 HDN.2 | HDS.1 6.02,18.92 arc90 6.27,18.67 6.34,18.67 6.4,18.67 arc90 6.65,18.92 HDS.2 | MXS.1 6.02,11.3 arc90 6.27,11.05 6.34,11.05 6.4,11.05 arc90 6.65,11.3 MXS.2
  Top 0.457: C66.1 v65.41,26.04 v65.41,26.67 | C69.1 v65.41,18.41 v65.41,19.05 | C72.1 v36.19,31.11 v36.19,30.48
  Top 0.508: C15.1 v41.27,35.56 v40.64,35.56 40.26,35.56 arc-90 40,35.81 40,38.49 arc-90 40.26,38.75 40.89,38.75 | C39.1 v60.32,21.59 v60.96,21.59 61.34,21.59 arc-90 61.59,21.34 61.59,18.66 arc-90 61.34,18.4 60.71,18.4 | C18.1 v50.8,35.56 v50.16,35.56 49.78,35.56 arc-90 49.53,35.81 49.53,38.49 arc-90 49.78,38.75 50.42,38.75 | C42.1 v50.8,21.59 v51.43,21.59 51.82,21.59 arc-90 52.07,21.34 52.07,18.66 arc-90 51.82,18.4 51.18,18.4 | C21.1 v60.32,35.56 v59.69,35.56 59.31,35.56 arc-90 59.05,35.81 59.05,38.49 arc-90 59.31,38.75 59.94,38.75 | C45.1 v41.27,21.59 v41.91,21.59 42.29,21.59 arc-90 42.54,21.34 42.54,18.66 arc-90 42.29,18.4 41.66,18.4 | C24.1 v69.85,35.56 v69.22,35.56 68.83,35.56 arc-90 68.58,35.81 68.58,38.49 arc-90 68.83,38.75 69.47,38.75 | C48.1 v31.75,21.59 v32.38,21.59 32.77,21.59 arc-90 33.02,21.34 33.02,18.66 arc-90 32.77,18.4 32.13,18.4 | C57.1 v9.52,26.67 v9.52,26.04 9.52,25.65 arc-90 9.27,25.4 6.59,25.4 arc-90 6.34,25.65 6.34,26.29 | C63.1 v9.52,41.91 v9.52,41.27 9.52,40.89 arc-90 9.27,40.64 6.59,40.64 arc-90 6.34,40.89 6.34,41.53 | v65.41,26.67 65.41,27.05 arc-90 65.66,27.3 68.34,27.3 arc-90 68.59,27.05 68.59,26.42 | v65.41,19.05 65.41,19.43 arc-90 65.66,19.68 68.34,19.68 arc-90 68.59,19.43 68.59,18.8 | C75.1 v36.19,38.73 v36.19,38.1 36.19,37.72 arc-90 35.94,37.47 33.26,37.47 arc-90 33.01,37.72 33.01,38.35 | v36.19,30.48 36.19,30.1 arc-90 35.94,29.84 33.26,29.84 arc-90 33.01,30.1 33.01,30.73 | C60.1 v9.52,34.29 v9.52,33.66 9.52,33.27 arc-90 9.27,33.02 6.59,33.02 arc-90 6.34,33.27 6.34,33.91 | C54.1 v9.52,19.05 v9.52,18.41 9.52,18.03 arc-90 9.27,17.78 6.59,17.78 arc-90 6.34,18.03 6.34,18.67
  Top 0.508: C51.1 v9.52,11.43 v9.52,10.79 9.52,10.41 arc-90 9.27,10.16 6.59,10.16 arc-90 6.34,10.41 6.34,11.05
  Top 0.813: R88.2 v88.67,23.49
  Bottom 0.152: MNW.1 18.4,38.1 C78.1 | MSE.1 83.2,19.05 C81.1 | U22.4 90.81,28.07 90.81,27.3 90.17,26.67 v89.53,26.67
  Bottom 0.203: C78.1 18.41,38.07 v18.41,36.51 | C81.1 83.19,19.08 v83.19,20.64
  Bottom 0.406: C27.1 17.78,20.95 arc90 17.4,20.57 v17.4,19.68 | C30.1 17.78,16.51 arc90 17.4,16.13 v17.4,15.24 | C33.1 83.82,36.2 arc90 84.2,36.58 v84.2,37.47 | C36.1 83.82,40.64 arc90 84.2,41.02 v84.2,41.91
  Bottom 0.813: v88.67,25.4 v88.67,24.45 v88.67,23.49 94.23,23.49 | 94.23,23.49 U26.3 | 94.23,23.49 94.23,22.17 C83.1
  pour Route2: 8.25,43.81 11.43,43.81 11.43,37.47 19.05,37.47 19.05,34.29 11.43,34.29 11.43,20.95 30.48,20.95 30.48,22.86 63.5,22.86 63.5,27.3 69.85,27.3 69.85,22.23 80.01,22.23 80.01,34.29 38.1,34.29 38.1,29.84 31.75,29.84 31.75,40 78.1,40 78.1,43.81 85.09,43.81 85.09,26.04 89.85,26.04 89.85,16.51 64.13,16.51 64.13,17.78 22.22,17.78 22.22,13.97 11.43,13.97 11.43,8.89 8.25,8.89
BETA_TDO  (via drill 0.25)
  Top 0.203: BETA.3 v69.6,54.61
  Route15 0.203: v69.6,54.61 70.31,55.32 arc-45 70.58,55.44 88.5,55.44 arc-45 88.77,55.32 89.69,54.4 arc-45 89.81,54.13 JP1.2
CD  (via drill 0.25)
  Top 0.203: U$1.CD1 v90.04,9.62
  Bottom 0.203: v90.04,9.62 U99.1
CLK  (via drill 0.25)
  Top 0.203: U$1.5 v94.61,12.22
  Bottom 0.203: v94.61,12.22 93.1,12.22 arc45 92.83,12.11 92.16,11.44 arc45 92.05,11.17 U99.6
CMD  (via drill 0.25)
  Top 0.203: U$1.3 v94.61,14.42
  Bottom 0.203: v94.61,14.42 92.94,14.42 arc45 92.67,14.31 91.75,13.39 arc45 91.64,13.12 U99.5
DAT0  (via drill 0.25)
  Top 0.203: U$1.7 v94.61,10.02
  Bottom 0.203: v94.61,10.02 93.22,10.02 arc45 92.95,9.91 92.54,9.5 arc45 92.43,9.23 U99.7
DAT1  (via drill 0.25)
  Top 0.203: U$1.8 v94.61,8.92
  Bottom 0.203: v94.61,8.92 93.38,8.92 arc45 93.11,8.81 92.95,8.65 arc45 92.84,8.38 U99.8
DAT2  (via drill 0.25)
  Top 0.203: U$1.1 v94.61,16.62
  Bottom 0.203: v94.61,16.62 92.64,16.62 arc45 92.37,16.51 90.94,15.08 arc45 90.83,14.81 U99.3
DAT3  (via drill 0.25)
  Top 0.203: U$1.2 v94.61,15.52
  Bottom 0.203: v94.61,15.52 92.79,15.52 arc45 92.52,15.41 91.35,14.23 arc45 91.24,13.96 U99.4
E_I2C_V  (via drill 0.25 pad 0.25)
  Top 0.305: U13.1 81.28,42.86 arc90 81.66,43.24 81.66,53.59 arc90 81.28,53.97 PWR-NE.4
  Top 0.406: U13.1 v79.63,42.86
  Bottom 0.406: v79.63,42.86 79.7,42.79 arc45 79.97,42.68 C34.1
E_SDI_V  (via drill 0.25 pad 0.25)
  Top 0.305: U13.6 82.55,42.86 arc-90 82.17,43.24 82.17,53.59 arc-90 82.55,53.97 PWR-NE.2
  Top 0.406: U13.6 v84.2,42.86
  Bottom 0.406: v84.2,42.86 84.13,42.79 arc-45 83.86,42.68 C35.1
E_VE  (via drill 0.25 pad 0.25)
  Top 0.152: R81.2 v61.59,12.7
  Top 0.61: PWR-SE.4 PWR-SE.6 77.47,9.52 arc-90 76.83,10.16 76.83,11.43 arc90 76.2,12.06 64.29,12.06 arc-45 64.02,12.18 63.61,12.59 arc45 63.34,12.7 R81.2
  Bottom 0.152: U19.2 55.11,12.76 arc90 55.49,12.38 59.85,12.38 arc-45 60.12,12.27 60.21,12.18 arc45 60.48,12.06 60.8,12.06 arc45 61.07,12.18 v61.59,12.7
E_VE'  (via drill 0.25 pad 0.25)
  Top 0.152: R81.1 v60.32,12.7
  Top 0.508: L5.2 59.46,14.92 R81.1
  Bottom 0.152: U19.1 55.61,13.08 arc90 55.99,12.7 v60.32,12.7
EE_CLK1
  Bottom 0.152: R4.1 100.08,43.23 U2.4 100.13,44.2 arc90 99.87,44.45 96.65,44.45 96.53,44.34 U1.44
EE_CS1
  Bottom 0.152: U1.45 96.56,43.84 arc45 96.74,43.91 96.83,43.99 arc-45 97.01,44.07 98.93,44.07 arc-90 99.19,43.81 U2.5 R3.1
EE_DATA1
  Bottom 0.152: R6.2 99.76,47.03 arc45 99.84,46.85 100.05,46.63 arc-45 100.13,46.45 U2.3 100.13,45.09 arc-90 99.87,44.83 96.27,44.83 96.26,44.84 U1.43
EN1
  Top 0.152: U8.13 18.92,21.02 arc-90 18.54,20.63 U10.4
EN1B
  Top 0.152: U12.4 82.68,36.52 U9.13
EN2
  Top 0.152: U11.4 19.05,16.19 arc90 19.43,16.57 U8.14
EN2B
  Top 0.152: U13.4 82.55,40.96 arc90 82.17,40.58 U9.14
EN3
  Top 0.152: U8.16 20.45,21.02 arc90 20.83,20.63 U10.3
EN3B
  Top 0.152: U12.3 81.15,36.52 U9.16
EN4
  Top 0.152: U8.15 19.94,16.57 arc90 20.32,16.19 U11.3
EN4B
  Top 0.152: U9.15 81.66,40.58 arc90 81.28,40.96 U13.3
FTDI_D_N  (via drill 0.25 pad 0.25)
  Top 0.152: USB.2 v92.71,43.8 92.57,43.94 U3.1
  Bottom 0.152: U1.6 91.31,43.04 arc-90 92.07,43.8 v92.71,43.8
FTDI_D_P  (via drill 0.25 pad 0.25)
  Top 0.152: USB.3 v92.71,44.45 U3.2
  Bottom 0.152: U1.7 90.81,43.18 arc-90 92.08,44.45 v92.71,44.45
FTDI_TCK  (via drill 0.25)
  Top 0.203: BETA.1 v70.4,51.44
  Route15 0.203: v70.4,51.44 70.4,53.75 arc-45 70.51,54.02 70.92,54.44 arc-45 71.19,54.55 86.65,54.55 arc-45 86.92,54.44 87.33,54.02 arc-45 87.44,53.75 87.44,42.65 arc90 v87.76,42.34
  Bottom 0.203: ZED.1 v70.4,51.44 | U1.13 v87.76,42.34
FTDI_TDI  (via drill 0.25)
  Top 0.203: BETA.4 v69.6,46.99
  Route15 0.203: v69.6,46.99 69.6,49.12 arc-45 69.71,49.39 70.82,50.5 arc45 70.93,50.77 70.93,53.56 arc-45 71.04,53.83 71.2,53.99 arc-45 71.47,54.1 86.46,54.1 arc-45 86.73,53.99 86.88,53.83 arc-45 87,53.56 87,43.63 arc-45 86.88,43.36 86.47,42.95 arc-45 86.2,42.84 v85.85,42.84
  Bottom 0.203: v85.85,42.84 U1.14
FTDI_TDO  (via drill 0.25)
  Route15 0.203: v69.6,51.44 69.6,53.69 arc-45 69.71,53.96 70.63,54.88 arc-45 70.9,54.99 86.84,54.99 arc-45 87.11,54.88 87.77,54.21 arc-45 87.88,53.94 87.88,43.46 arc90 v88.01,43.34
  Bottom 0.203: ZED.3 v69.6,51.44 | U1.15 v88.01,43.34
FTDI_TMS  (via drill 0.25)
  Top 0.203: BETA.2 v70.4,46.99
  Route15 0.203: v85.85,43.84 86.01,43.84 arc45 86.28,43.95 86.44,44.1 arc45 86.55,44.37 86.55,53.4 arc90 86.3,53.66 71.63,53.66 arc90 71.37,53.4 71.37,50.58 arc-45 71.26,50.31 70.51,49.56 arc45 70.4,49.29 v70.4,46.99
  Bottom 0.203: ZED.2 v70.4,46.99 | U1.16 v85.85,43.84
GND  (via drill 0.25, 0.25 pad 0.25, 0.3 pad 0.25, 0.33 pad 0.25, 0.38 pad 0.25, 0.41 pad 0.25, 3.17 pad 4.5)
  Top 0.152: USB.5 97.47,46.36 v97.16,46.36
  Top 0.203: U3.3 92.58,44.96 v92.71,45.09 | C82.2 58.87,27.52 arc-90 59.12,27.77 U25.1 | C11.2 22.44,34.48 arc-90 22.69,34.22 U4.1 | U7.23 15.75,32.26 v15.88,32.38 | U6.23 50.04,27.81 v50.16,27.94 | C12.2 79.16,22.67 arc-90 78.91,22.93 U5.1
  Bottom 0.152: U2.2 99.19,46.36 arc90 98.93,46.61 97.16,46.61 v97.16,46.36
  Bottom 0.203: U44.6 70.63,29.52 arc45 70.9,29.63 71.33,30.05 arc45 71.44,30.32 v71.44,30.8 | U15.5 10.79,4.18 U15.EPAD | U14.5 10.79,52.97 U14.EPAD | U18.5 47.99,41.91 U18.EPAD | U20.5 67.04,41.91 v66.67,41.91 U20.EPAD | U17.5 34.56,15.24 U17.EPAD | U19.5 53.61,15.24 U19.EPAD | U21.5 71.75,21.23 v71.75,21.91 | U22.5 88.27,27.57 U22.EPAD
  other vias: 34.4,6.35 36.8,6.35 42.4,6.35 44.8,6.35 50.4,6.35 52.8,6.35 55.2,6.35 57.6,6.35 60,6.35 62.4,6.35 64.8,6.35 64.8,50.8 62.4,50.8 60,50.8 57.6,50.8 55.2,50.8 52.8,50.8 50.4,50.8 44.8,50.8 42.4,50.8 36.8,50.8 32.8,50.8 40,50.8 40,6.35 81.41,32.58 82.42,32.58 82.42,31.56 81.41,31.56 20.19,24.57 19.18,24.57 19.18,25.59 20.19,25.59 42.74,38.99 43.62,38.99 42.74,38.1 43.62,38.1 42.74,37.21 43.62,37.21 52.26,38.99 53.15,38.99 52.26,38.1 53.15,38.1 52.26,37.21 53.15,37.21 61.79,38.99 62.67,38.99 61.79,38.1 62.67,38.1 61.79,37.21 62.67,37.21 71.31,38.99 72.2,38.99 71.31,38.1 72.2,38.1 71.31,37.21 72.2,37.21 58.86,18.16 57.98,18.16 58.86,19.05 57.98,19.05 58.86,19.94 57.98,19.94 49.34,18.16 48.45,18.16 49.34,19.05 48.45,19.05 49.34,19.94 48.45,19.94 39.81,18.16 38.93,18.16 39.81,19.05 38.93,19.05 39.81,19.94 38.93,19.94 30.29,18.16 29.4,18.16 30.29,19.05 29.4,19.05 30.29,19.94 29.4,19.94 6.1,12.89 6.1,13.78 6.98,12.89 6.98,13.78 7.87,12.89 7.87,13.78 6.1,20.51 6.1,21.4 6.98,20.51 6.98,21.4 7.87,20.51 7.87,21.4 6.1,28.13 6.1,29.02 6.98,28.13 6.98,29.02 7.87,28.13 7.87,29.02 6.1,35.75 6.1,36.64 6.98,35.75 6.98,36.64 7.87,35.75 7.87,36.64 6.1,43.37 6.1,44.26 6.98,43.37 6.98,44.26 7.87,43.37 7.87,44.26 10.48,22.23 10.48,21.59 4.13,19.05 4.76,19.05 41.27,40.96 41.27,40.32 43.81,34.61 44.45,34.61 10.48,14.6 10.48,13.97 4.13,11.43 4.76,11.43 10.48,29.84 10.48,29.21 4.13,26.67 4.76,26.67 10.48,37.47 10.48,36.83 4.13,34.29 4.76,34.29 10.48,45.09 10.48,44.45 4.13,41.91 4.76,41.91 31.75,16.19 31.75,16.83 29.21,22.54 28.57,22.54 41.27,16.19 41.27,16.83 38.73,22.54 38.1,22.54 50.8,16.19 50.8,16.83 48.26,22.54 47.62,22.54 60.32,16.19 60.32,16.83 57.78,22.54 57.15,22.54 69.85,40.96 69.85,40.32 72.39,34.61 73.03,34.61 60.32,40.96 60.32,40.32 62.86,34.61 63.5,34.61 50.8,40.96 50.8,40.32 53.34,34.61 53.97,34.61 15.88,33.66 17.14,33.66 17.14,32.38 50.16,29.21 51.43,29.21 51.43,27.94 68.83,24.57 68.83,23.69 67.94,24.57 67.94,23.69 67.06,24.57 67.06,23.69 68.83,16.95 68.83,16.07 67.94,16.95 67.94,16.07 67.06,16.95 67.06,16.07 32.77,32.58 32.77,33.46 33.66,32.58 33.66,33.46 34.54,32.58 34.54,33.46 32.77,40.2 32.77,41.08 33.66,40.2 33.66,41.08 34.54,40.2 34.54,41.08 64.45,15.24 64.45,15.88 70.8,18.41 70.17,18.41 64.45,22.86 64.45,23.49 70.8,26.04 70.17,26.04 37.15,34.29 37.15,33.66 30.8,31.11 31.43,31.11 37.15,41.91 37.15,41.27 30.8,38.73 31.43,38.73 13.97,35.56 17.78,27.3 48.26,31.11 83.82,29.84 10.79,53.97 13.97,47.62 10.79,3.18 29.84,35.24 88.27,28.57 0.63,22.23 14.6,28.57 26.03,30.48 40,28.57 40,32.38 45.72,28.57 60.96,25.4 45.08,11.43 56.52,45.72 73.03,8.25 73.03,4.45 28.57,8.25 28.57,4.45 34.4,10.16 34.4,2.54 36.8,10.16 36.8,2.54 40,10.16 42.4,10.16 42.4,2.54 44.8,10.16 44.8,2.54 50.4,10.16 50.4,2.54 52.8,2.54 52.8,10.16 57.6,2.54 57.6,10.16 60,2.54 60,10.16 62.4,10.16 62.4,2.54 32.8,54.61 32.8,46.99 36.8,46.99 36.8,54.61 40,54.61 42.4,54.61 42.4,46.99 44.8,46.99 44.8,54.61 50.4,54.61 50.4,46.99 52.8,46.99 52.8,54.61 57.6,54.61 57.6,46.99 60,46.99 60,54.61 62.4,54.61 62.4,46.99 64.8,54.61 64.8,46.99 28.57,48.89 28.57,52.7 73.03,52.7 73.03,48.89 3.81,53.34 97.79,53.34 97.79,3.81 3.81,3.81 65.41,41.91 46.35,41.91 47.62,41.91 34.92,15.24 36.19,15.24 53.97,15.24 55.24,15.24 13.97,9.52 81.28,23.49 85.72,23.49 81.28,26.67 85.72,26.67 85.72,20.32 91.44,20.32 91.44,24.77 91.44,32.38 86.36,36.83 99.69,36.83
  pour Top (rank 3): 101.6,0 0,0 0,57.15 101.6,57.15
  pour Bottom (rank 3): 101.6,0 0,0 0,57.15 101.6,57.15
  pour Route15: 27.3,55.25 27.3,46.36 74.3,46.36 74.3,55.25
  pour Route15: 27.3,10.79 27.3,1.9 74.3,1.9 74.3,10.79
GPA0_C
  Top 0.203: NE.5 73.72,37.13 arc-90 73.98,36.88 73.98,32.92 arc-45 73.87,32.65 72.95,31.73 arc-45 72.68,31.62 51.59,31.62 arc45 51.32,31.51 51.17,31.35 arc45 51.05,31.08 U6.15
GPA0_W
  Top 0.203: U7.15 16.76,36.55 arc45 16.65,36.81 15.73,37.73 arc45 15.46,37.85 13.24,37.85 arc-45 12.97,37.96 12.68,38.24 arc-45 12.57,38.51 12.57,40.8 arc45 12.46,41.07 11.54,41.99 arc-45 11.43,42.26 11.43,45.12 arc45 11.32,45.39 10.91,45.8 arc45 10.64,45.91 8.2,45.91 arc90 7.95,45.66 MXN.5
GPA1_C  (via drill 0.25 pad 0.25)
  Top 0.203: NE.3 69.47,37.77 arc90 69.22,37.52 v69.22,36.83 | U6.16 50.55,31.34 arc-45 50.66,31.61 51.07,32.02 arc-45 51.34,32.13 68.17,32.13 arc45 68.44,32.24 69.1,32.91 arc45 69.22,33.18 v69.22,34.29
  Bottom 0.203: v69.22,36.83 68.96,36.83 arc90 68.58,36.45 68.58,34.67 arc90 68.96,34.29 v69.22,34.29
GPA1_W  (via drill 0.25 pad 0.25)
  Top 0.203: U7.16 16.26,36.29 arc45 16.14,36.56 15.48,37.23 arc45 15.21,37.34 12.98,37.34 arc-45 12.71,37.45 12.18,37.99 arc-45 12.06,38.26 12.06,40.61 arc45 11.95,40.88 11.67,41.16 arc45 11.4,41.27 v10.79,41.27 | MXN.3 7.31,41.53 arc90 7.57,41.27 v8.25,41.27
  Bottom 0.203: v8.25,41.27 8.25,41.02 arc90 8.64,40.64 10.41,40.64 arc90 10.79,41.02 v10.79,41.27
GPA2_C
  Top 0.203: NN.5 64.2,37.13 arc-90 64.45,36.88 64.45,34.07 arc-45 64.34,33.8 63.29,32.75 arc-45 63.02,32.64 51.08,32.64 arc45 50.81,32.53 50.15,31.86 arc45 50.04,31.59 U6.17
GPA2_W
  Top 0.203: U7.17 15.75,36.04 arc45 15.64,36.31 15.22,36.72 arc45 14.95,36.83 12.79,36.83 arc-45 12.52,36.94 11.29,38.18 arc45 11.02,38.29 8.2,38.29 arc90 7.95,38.04 HDN.5
GPA3_C  (via drill 0.25 pad 0.25)
  Top 0.203: NN.3 59.94,37.77 arc90 59.69,37.52 v59.69,36.83 | U6.18 49.55,31.85 arc-45 49.67,32.12 50.59,33.03 arc-45 50.86,33.15 59.15,33.15 arc45 59.42,33.26 59.58,33.42 arc45 59.69,33.69 v59.69,34.29
  Bottom 0.203: v59.69,36.83 59.44,36.83 arc90 59.05,36.45 59.05,34.67 arc90 59.44,34.29 v59.69,34.29
GPA3_W  (via drill 0.25 pad 0.25)
  Top 0.203: U7.18 15.27,35.78 arc45 15.15,36.05 15.12,36.08 arc45 14.85,36.2 11.18,36.2 arc90 10.79,35.81 v10.79,33.66 | HDN.3 7.31,33.91 arc90 7.57,33.66 v8.25,33.66
  Bottom 0.203: v8.25,33.66 8.25,33.4 arc90 8.64,33.02 10.41,33.02 arc90 10.79,33.4 v10.79,33.66
GPA4_C
  Top 0.203: NW.5 54.67,37.13 arc-90 54.93,36.88 54.93,34.07 arc-45 54.82,33.8 54.78,33.77 arc-45 54.52,33.66 48.04,33.66 arc45 47.77,33.54 47.61,33.39 arc45 47.5,33.12 47.5,30.36 arc45 47.61,30.09 47.77,29.93 arc45 48.04,29.82 U6.19
GPA4_W
  Top 0.203: U7.19 12.73,34.27 arc45 12.46,34.15 11.54,33.23 arc45 11.43,32.96 11.43,31.05 arc-90 11.05,30.67 8.2,30.67 arc90 7.95,30.42 VIO.5
GPA5_C  (via drill 0.25 pad 0.25)
  Top 0.203: NW.3 50.42,37.77 arc90 50.16,37.52 v50.16,36.83 | U6.20 47.78,29.34 arc-45 47.51,29.45 47.1,29.86 arc-45 46.99,30.13 46.99,33.37 arc-45 47.1,33.64 47.64,34.18 arc-45 47.91,34.29 v50.16,34.29
  Bottom 0.203: v50.16,36.83 49.91,36.83 arc90 49.53,36.45 49.53,34.67 arc90 49.91,34.29 v50.16,34.29
GPA5_W  (via drill 0.25 pad 0.25)
  Top 0.203: U7.20 12.98,33.78 arc45 12.71,33.67 12.05,33 arc45 11.94,32.73 11.94,26.57 arc-45 11.83,26.3 11.67,26.15 arc-45 11.4,26.04 v10.79,26.04 | VIO.3 7.31,26.29 arc90 7.57,26.04 v8.25,26.04
  Bottom 0.203: v10.79,26.04 10.79,25.78 arc-90 10.41,25.4 8.64,25.4 arc-90 8.25,25.78 v8.25,26.04
GPA6_C
  Top 0.203: WW.5 45.15,37.13 arc-90 45.4,36.88 45.4,34.77 arc45 45.51,34.5 46.37,33.64 arc-45 46.48,33.37 46.48,29.88 arc45 46.59,29.61 47.26,28.94 arc45 47.53,28.83 U6.21
GPA6_W
  Top 0.203: U7.21 13.24,33.27 arc45 12.97,33.16 12.56,32.75 arc45 12.45,32.48 12.45,23.72 arc-45 12.33,23.45 12.05,23.16 arc-45 11.78,23.05 8.2,23.05 arc90 7.95,22.8 HDS.5
GPA7_C  (via drill 0.25 pad 0.25)
  Top 0.203: WW.3 40.89,37.77 arc90 40.64,37.52 v40.64,36.83 | v40.64,34.29 40.64,34.04 arc90 41.02,33.66 45.43,33.66 arc-45 45.7,33.54 45.86,33.39 arc-45 45.97,33.12 45.97,29.62 arc45 46.09,29.35 47,28.43 arc45 47.27,28.32 U6.22
  Bottom 0.203: v40.64,36.83 40.39,36.83 arc90 40,36.45 40,34.67 arc90 40.39,34.29 v40.64,34.29
GPA7_W  (via drill 0.25 pad 0.25)
  Top 0.203: U7.22 13.49,32.77 arc45 13.22,32.65 13.07,32.5 arc45 12.95,32.23 12.95,19.21 arc-45 12.84,18.94 12.43,18.53 arc-45 12.16,18.41 v10.79,18.41 | HDS.3 7.31,18.67 arc90 7.57,18.41 v8.25,18.41
  Bottom 0.203: v8.25,18.41 8.25,18.16 arc90 8.64,17.78 10.41,17.78 arc90 10.79,18.16 v10.79,18.41
GPB0_C
  Top 0.203: SW.5 27.88,20.02 arc-90 27.62,20.27 27.62,24.23 arc-45 27.73,24.5 28.65,25.41 arc-45 28.92,25.53 46.96,25.53 arc45 47.23,25.64 47.51,25.92 arc45 47.62,26.19 47.62,26.79 arc-45 47.74,27.06 47.89,27.22 arc-45 48.16,27.33 U6.24
GPB0_W
  Top 0.203: U7.24 13.87,31.77 arc45 13.6,31.66 13.57,31.63 arc45 13.46,31.36 13.46,16.35 arc-45 13.35,16.08 12.81,15.54 arc-45 12.54,15.43 8.2,15.43 arc90 7.95,15.18 MXS.5
GPB1_C  (via drill 0.25 pad 0.25)
  Top 0.203: SW.3 32.13,19.38 arc90 32.38,19.63 v32.38,20.32 | U6.1 49.55,25.94 arc-45 49.44,25.67 48.9,25.13 arc-45 48.64,25.02 33.43,25.02 arc45 33.16,24.91 32.5,24.24 arc45 32.38,23.97 v32.38,22.86
  Bottom 0.203: v32.38,20.32 32.64,20.32 arc90 33.02,20.7 33.02,22.48 arc90 32.64,22.86 v32.38,22.86
GPB1_W  (via drill 0.25 pad 0.25, 0.3 pad 0.25)
  Top 0.203: U7.1 15.27,30.26 arc-45 15.15,29.99 15.12,29.96 arc-45 14.85,29.84 14.38,29.84 arc45 14.11,29.73 14.08,29.7 arc45 13.97,29.43 13.97,16.03 arc-45 13.86,15.76 10.91,12.81 arc45 10.79,12.54 v10.79,10.79 | MXS.3 7.31,11.05 arc90 7.57,10.79 v8.25,10.79
  Bottom 0.203: v8.25,10.79 8.25,10.54 arc90 8.64,10.16 10.41,10.16 arc90 10.79,10.54 v10.79,10.79
GPB2_C
  Top 0.203: SS.5 37.4,20.02 arc-90 37.15,20.27 37.15,23.72 arc-45 37.26,23.99 37.67,24.4 arc-45 37.94,24.51 48.86,24.51 arc45 49.13,24.62 49.93,25.41 arc45 50.04,25.68 U6.2
GPB3_C  (via drill 0.25 pad 0.25)
  Top 0.203: SS.3 41.66,19.38 arc90 41.91,19.63 v41.91,20.32 | U6.3 50.55,25.43 arc-45 50.43,25.16 49.39,24.11 arc-45 49.12,24 42.45,24 arc45 42.18,23.89 42.02,23.73 arc45 41.91,23.46 v41.91,22.86
  Bottom 0.203: v41.91,20.32 42.16,20.32 arc90 42.54,20.7 42.54,22.48 arc90 42.16,22.86 v41.91,22.86
GPB4_C
  Top 0.203: SE.5 46.93,20.02 arc-90 46.67,20.27 46.67,23.11 arc-90 47.05,23.49 49.37,23.49 arc45 49.64,23.61 50.94,24.91 arc45 51.05,25.18 U6.4
GPB5_C  (via drill 0.25 pad 0.25)
  Top 0.203: SE.3 51.18,19.38 arc90 51.43,19.63 v51.43,20.32 | U6.5 51.56,23.67 arc-45 51.52,23.59 51.47,23.53 arc45 51.43,23.44 v51.43,22.86
  Bottom 0.203: v51.43,20.32 51.69,20.32 arc90 52.07,20.7 52.07,22.48 arc90 51.69,22.86 v51.43,22.86
GPB6_C
  Top 0.203: EE.5 56.45,20.02 arc-90 56.2,20.27 56.2,23.49 53.34,23.49 arc-45 53.08,23.61 52.16,24.53 arc-45 52.04,24.8 U6.6
GPB7_C  (via drill 0.25 pad 0.25, 0.33 pad 0.25)
  Top 0.203: EE.3 60.71,19.38 arc90 60.96,19.63 v60.96,20.32 | U6.7 52.76,24.87 arc45 52.87,24.6 53.35,24.11 arc45 53.62,24 60.17,24 arc-45 60.44,23.89 60.85,23.48 arc-45 60.96,23.21 v60.96,22.86
  Bottom 0.203: v60.96,20.32 61.21,20.32 arc90 61.59,20.7 61.59,22.48 arc90 61.21,22.86 v60.96,22.86
JTAG_V  (via drill 0.25 pad 0.25)
  Top 0.305: PWR-SW.2 19.05,3.18 arc90 19.43,3.56 19.43,13.91 arc90 19.05,14.29 U11.6 v17.4,14.29
  Bottom 0.406: C29.1 17.74,14.47 arc45 17.47,14.36 v17.4,14.29
JX1_00_N  (via drill 0.25)
  Top 0.152: BETA.13 v65.6,51.44
  Bottom 0.152: ZED.13 v65.6,51.44
JX1_00_P  (via drill 0.25)
  Top 0.152: BETA.11 v66.4,51.44
  Bottom 0.152: ZED.11 v66.4,51.44
JX1_01_N  (via drill 0.25)
  Top 0.152: BETA.14 v65.6,50.16
  Bottom 0.152: ZED.14 v65.6,50.16
JX1_01_P  (via drill 0.25)
  Top 0.152: BETA.12 v66.4,50.16
  Bottom 0.152: ZED.12 v66.4,50.16
JX1_02_N  (via drill 0.25)
  Top 0.152: BETA.19 v63.2,51.44
  Bottom 0.152: ZED.19 v63.2,51.44
JX1_02_P  (via drill 0.25)
  Top 0.152: BETA.17 v64,51.44
  Bottom 0.152: ZED.17 v64,51.44
JX1_03_N  (via drill 0.25)
  Top 0.152: BETA.20 v63.2,50.16
  Bottom 0.152: ZED.20 v63.2,50.16
JX1_03_P  (via drill 0.25)
  Top 0.152: BETA.18 v64,50.16
  Bottom 0.152: ZED.18 v64,50.16
JX1_04_N  (via drill 0.25)
  Top 0.152: BETA.25 v60.8,51.44
  Bottom 0.152: ZED.25 v60.8,51.44
JX1_04_P  (via drill 0.25)